# EAGLE design stm32f103c8_jlinkob_v2 (EAGLE 7.6.0)
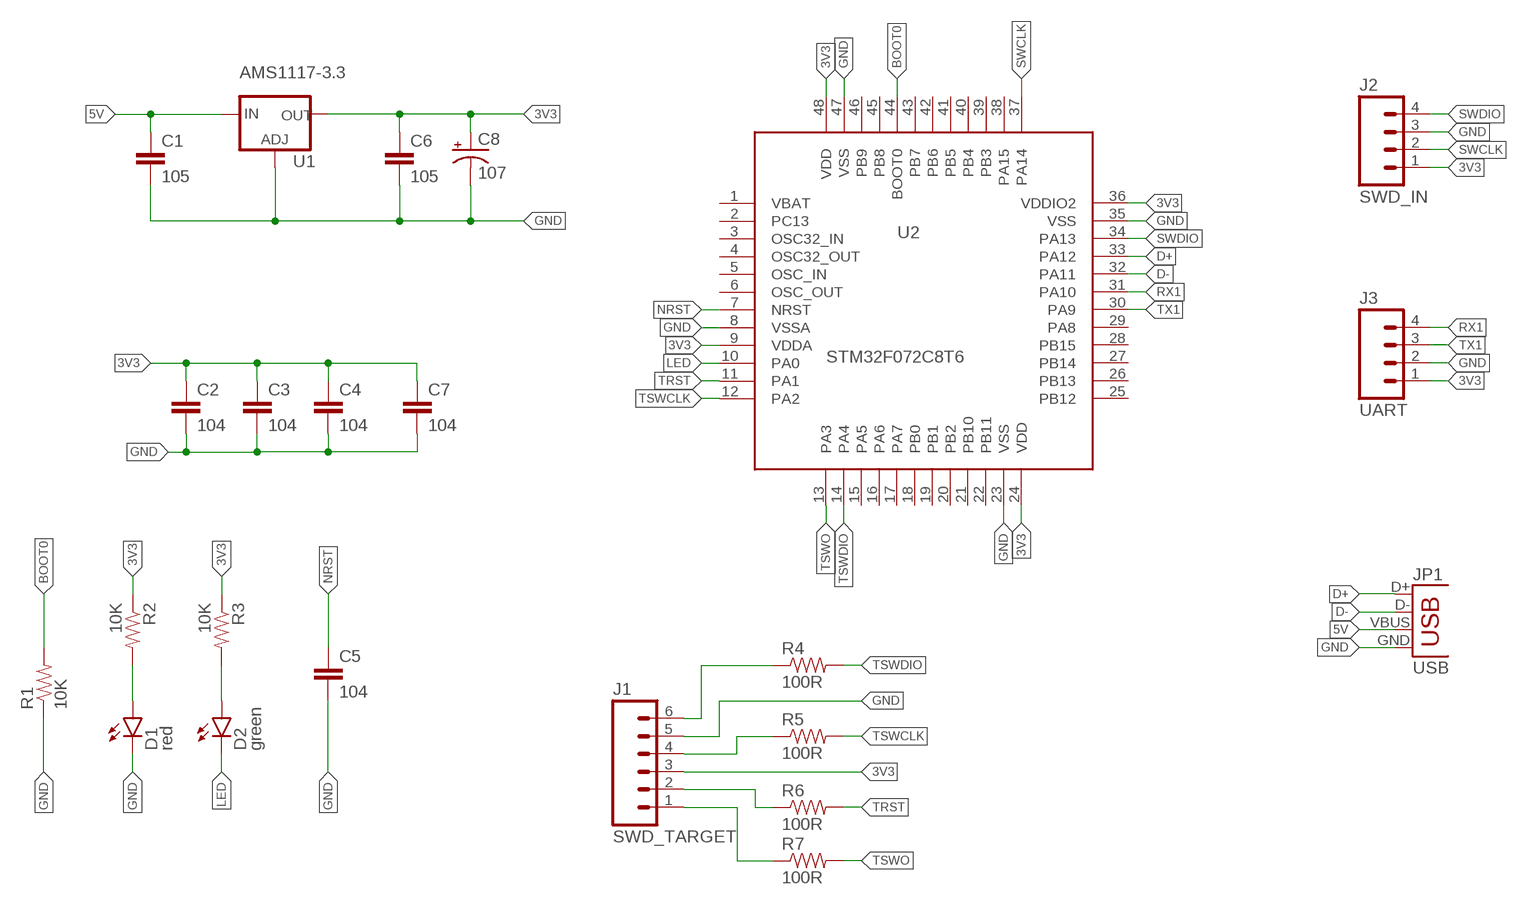
[diagram p0: schematic, sheet 1]

## Parts
C1  105  CAP0603-CAP  [0603-CAP]
C2  104  CAP0603-CAP  [0603-CAP]
C3  104  CAP0603-CAP  [0603-CAP]
C4  104  CAP0603-CAP  [0603-CAP]
C5  104  CAP0603-CAP  [0603-CAP]
C6  105  CAP0603-CAP  [0603-CAP]
C7  104  CAP0603-CAP  [0603-CAP]
C8  107  CAP_POL3528  [EIA3528]
D1  red  LED-SEEED-0603  [LED-0603-SEEED]
D2  green  LED-SEEED-0603  [LED-0603-SEEED]
J1  SWD_TARGET  M06NO_SILK_FEMALE_PTH  [1X06_NO_SILK]
J2  SWD_IN  M041X04_NO_SILK  [1X04_NO_SILK]
J3  UART  M041X04_NO_SILK  [1X04_NO_SILK]
JP1  USB  [MICROUSB-U-F-M5DD-Y-1]
R1  10K  RESISTOR0603  [0603-RES]
R2  10K  RESISTOR0603  [0603-RES]
R3  10K  RESISTOR0603  [0603-RES]
R4  100R  RESISTOR0603  [0603-RES]
R5  100R  RESISTOR0603  [0603-RES]
R6  100R  RESISTOR0603  [0603-RES]
R7  100R  RESISTOR0603  [0603-RES]
U1  AMS1117-3.3  AMS1117SOT223  [SOT223]
U2  STM32F072C8T6  [LQFP-48]

## Nets
3V3: C2.1 C3.1 C4.1 C6.1 C7.1 C8.A(+) J1.3 J2.1 J3.1 R2.1 R3.1 U1.2(OUT) U1.4(OUT) U2.9(VDDA) U2.24(VDD) U2.36(VDDIO2) U2.48(VDD)
5V: C1.1 JP1.VBUS U1.3(IN)
BOOT0: R1.2 U2.44(BOOT0)
D+: JP1.D+ U2.33(PA12)
D-: JP1.D- U2.32(PA11)
GND: C1.2 C2.2 C3.2 C4.2 C5.2 C6.2 C7.2 C8.C(-) D1.-(C) J1.5 J2.3 J3.2 JP1.GND R1.1 U1.1(ADJ) U2.8(VSSA) U2.23(VSS) U2.35(VSS) U2.47(VSS)
LED: D2.-(C) U2.10(PA0)
N$1: D2.+(A) R3.2
N$2: J1.6 R4.1
N$4: J1.4 R5.1
N$5: D1.+(A) R2.2
N$7: J1.2 R6.1
N$8: J1.1 R7.1
NRST: C5.1 U2.7(NRST)
RX1: J3.4 U2.31(PA10)
SWCLK: J2.2 U2.37(PA14)
SWDIO: J2.4 U2.34(PA13)
TRST: R6.2 U2.11(PA1)
TSWCLK: R5.2 U2.12(PA2)
TSWDIO: R4.2 U2.14(PA4)
TSWO: R7.2 U2.13(PA3)
TX1: J3.3 U2.30(PA9)
Unconnected: U2.1(VBAT) U2.2(PC13) U2.3(OSC32_IN) U2.4(OSC32_OUT) U2.5(OSC_IN) U2.6(OSC_OUT) U2.15(PA5) U2.16(PA6) U2.17(PA7) U2.18(PB0) U2.19(PB1) U2.20(PB2) U2.21(PB10) U2.22(PB11) U2.25(PB12) U2.26(PB13) U2.27(PB14) U2.28(PB15) U2.29(PA8) U2.38(PA15) U2.39(PB3) U2.40(PB4) U2.41(PB5) U2.42(PB6) U2.43(PB7) U2.45(PB8) U2.46(PB9)

## Library data of the parts
C1-C7 = z_jlc_smt:CAP: Capacitor Standard 0603 ceramic capacitor, and 0.1" leaded capacitor.
C8 = z_jlc_smt:CAP_POL: Capacitor Polarized These are standard SMD and PTH capacitors. Normally 10uF, 47uF, and 100uF in electrolytic and tantalum varieties. Always verify the external diameter of the through hole cap, it varies with capacity, voltage, and manufacturer. The EIA devices should be standard.
D1 D2 = z_jlc_smt:LED: LEDs Standard schematic elements and footprints for 5mm, 3mm, 1206, and 0603 sized LEDs. 5mm - Spark Fun Electronics SKU : COM-00529 (and others)
J1 = SparkFun-Connectors:M06: Header 6 Standard 6-pin 0.1" header. Use with straight break away headers (SKU : PRT-00116), right angle break away headers (PRT-00553), swiss pins (PRT-00743), machine pins (PRT-00117), and female headers (PRT-00115). Molex polarized connector foot print use with SKU : PRT-08094 with associated crimp pins and housings. NOTES ON THE VARIANTS LOCK and LOCK_LONGPADS... This footprint was designed to help hold the alignment of a through-hole component (i.e. 6-pin header) while soldering it into place. You may notice that each hole has been shifted either up or down by 0.005 of an inch from it's more standard position (which is a perfectly straight line). This slight alteration caused the pins (the squares in the middle) to touch the edges of the holes. Because they are alternating, it causes a "brace" to hold the component in place. 0.005 has proven to be the perfect amount of "off-center" position when using our standard breakaway headers. Although looks a little odd when you look at the bare footprint, once you have a header in there, the alteration is very hard to notice. Also,if you push a header all the way into place, it is covered up entirely on the bottom side. This idea of altering the position of holes to aid alignment will be further integrated into the Sparkfun Library for other footprints. It can help hold any component with 3 or more connection pins.; PROD_ID: CONN-08437
J2 J3 = SparkFun-Connectors:M04: Header 4 Standard 4-pin 0.1" header. Use with straight break away headers (SKU : PRT-00116), right angle break away headers (PRT-00553), swiss pins (PRT-00743), machine pins (PRT-00117), and female headers (PRT-00115). Molex polarized connector foot print use with SKU : PRT-08231 with associated crimp pins and housings. 1MM SMD Version SKU: PRT-10208; PROD_ID: CONN-09696
JP1 = xmgu2008:USB: USB Connectors USB-B-PTH is fully proven SKU : PRT-00139/CONN-08278 USB-miniB is fully proven SKU : PRT-00587 USB-A-PCB is untested. USB-A-H is throughly reviewed, but untested. Spark Fun Electronics SKU : PRT-00437 USB-B-SMT is throughly reviewed, but untested. Needs silkscreen touching up. USB-A-S has not been used/tested USB-MB-H has not been used/tested USB-MICROB has been used. CONN-09505
R1-R7 = z_jlc_smt:RESISTOR: Resistor Basic schematic elements and footprints for 0603, 1206, and PTH resistors.
U1 = z_jlc_smt:AMS1117: Voltage Regulator AMS1117; PROD_ID: VREG-08170
U2 = z_jlc_smt:STM32F072C8T6

## Board
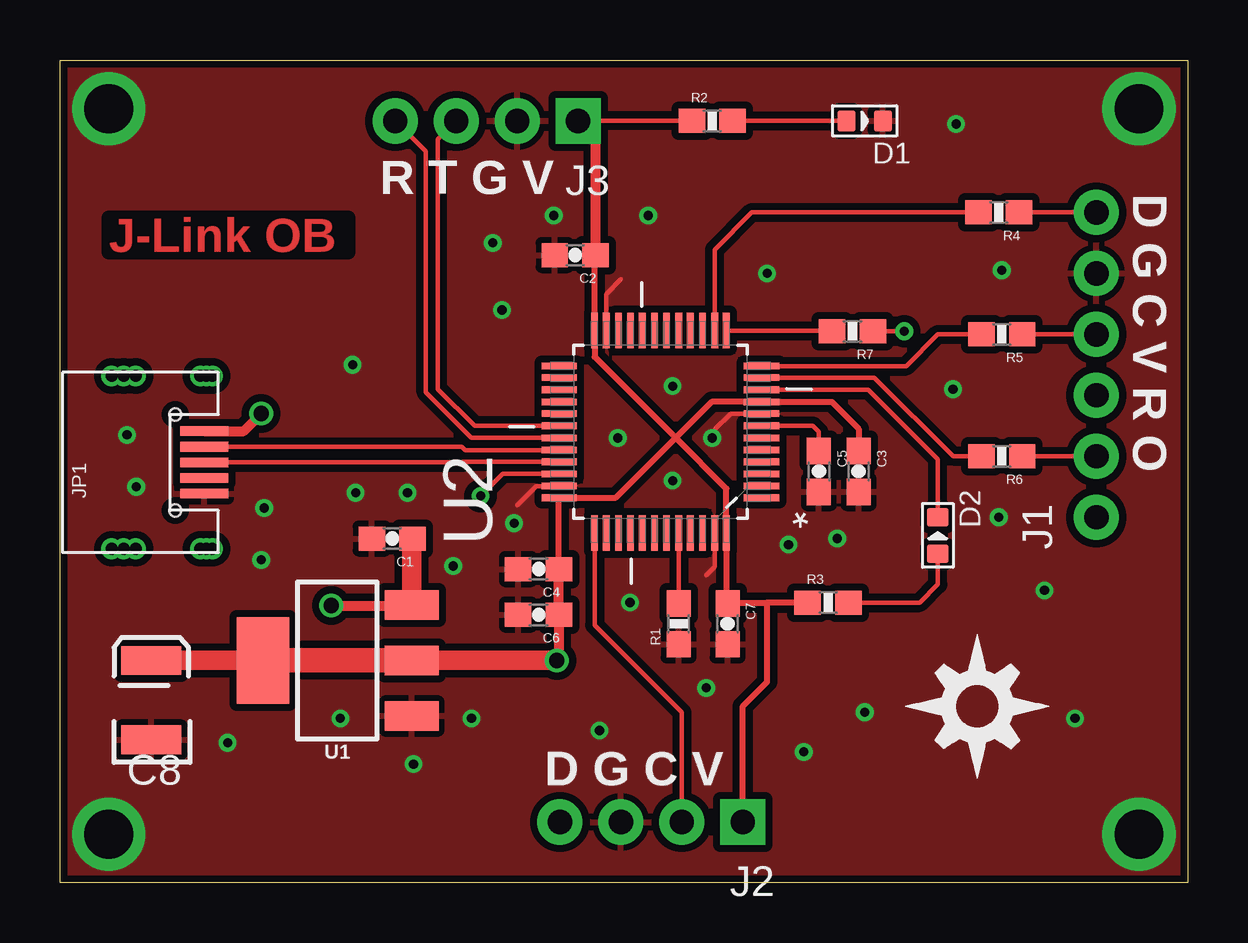
[diagram p1: board, top side]
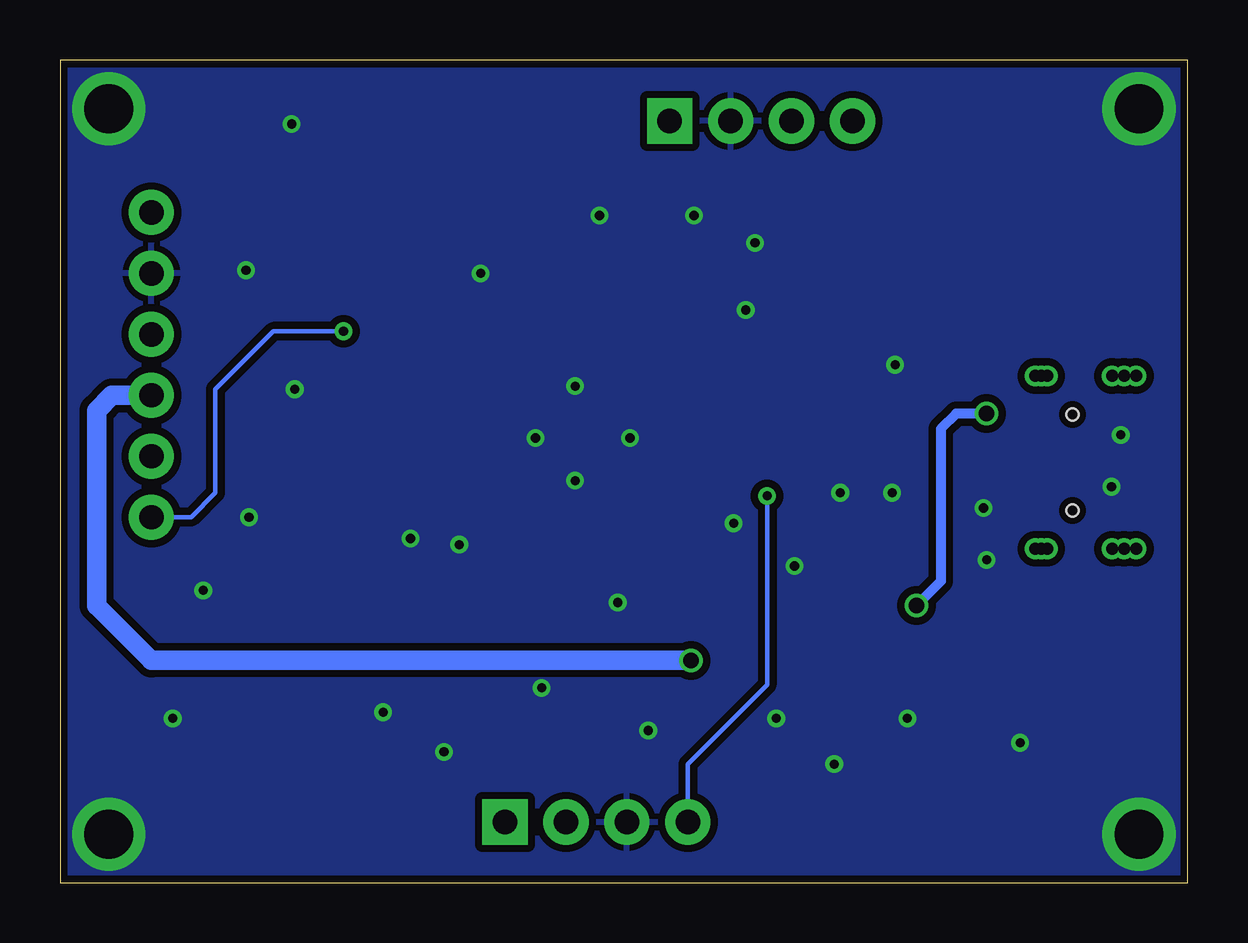
[diagram p2: board, bottom side, seen from below]

Size 46.99 x 34.29 mm. Coordinates in mm from the lower left corner, seen from the top.
Outline: 0,0 0,34.29 46.99,34.29 46.99,0 0,0
Copper layers (1*16): Top 0.035mm / dielectric 1.5mm / Bottom 0.035mm
Design rules "SparkFun-2-layer-TIGHT": minimum track width 7mil, minimum drill 15mil, track to track 7mil, track to pad 7mil, pad to pad 7mil, via to via 7mil, smd to smd 7mil, copper to edge 7mil, drill to drill 7mil, minimum pad ring 7mil, minimum via ring 7mil, stop-mask expansion 4mil, vias tented up to drill 20mil, thermal gap 10mil

### Footprints (pad centres in the part's own frame; a part is rotated, then mirrored left to right if it is on the bottom)
0603-CAP = smd 1.1 x 1: 1 -0.85,0; 2 0.85,0
EIA3528 = smd 1.2 x 2.5: A 1.65,0; C -1.65,0
LED-0603-SEEED = smd 0.762 x 0.889: + 0.762,0; - -0.762,0
1X06_NO_SILK = drill 1.016 pad 1.88: 1 0,0; 2 2.54,0; 3 5.08,0; 4 7.62,0; 5 10.16,0; 6 12.7,0
1X04_NO_SILK = drill 1.016 pad 1.88 square: 1 0,0 | drill 1.016 pad 1.88: 2 2.54,0; 3 5.08,0; 4 7.62,0
MICROUSB-U-F-M5DD-Y-1 = drill 0.5: 6_1 3.6,0.25; 6_2 3.6,0.5; 6_3 3.6,0.75; 7_1 3.6,3.45; 7_2 3.6,3.95; 7_3 3.6,4.45; 8_1 -3.6,4.45; 8_2 -3.6,3.95; 8_3 -3.6,3.45; 9_1 -3.6,0.75; 9_2 -3.6,0.5; 9_3 -3.6,0.25 | smd 0.4 x 2: D+ 0,0.6; D- 0.65,0.6; GND -1.3,0.6; ID -0.65,0.6; VBUS 1.3,0.6 | hole 0.5: -2,1.8; 2,1.8
0603-RES = smd 1.1 x 1: 1 -0.85,0; 2 0.85,0
SOT223 = smd 2.235 x 1.219: 1 3.099,-2.311; 2 3.099,0; 3 3.099,2.311 | smd 2.2 x 3.6: 4 -3.099,0
LQFP-48 = smd 0.279 x 1.473: 1 -2.743,-4.216; 2 -2.261,-4.216; 3 -1.753,-4.216; 4 -1.245,-4.216; 5 -0.762,-4.216; 6 -0.254,-4.216; 7 0.254,-4.216; 8 0.762,-4.216; 9 1.245,-4.216; 10 1.753,-4.216; 11 2.261,-4.216; 12 2.743,-4.216; 25 2.743,4.216; 26 2.261,4.216; 27 1.753,4.216; 28 1.245,4.216; 29 0.762,4.216; 30 0.254,4.216; 31 -0.254,4.216; 32 -0.762,4.216; 33 -1.245,4.216; 34 -1.753,4.216; 35 -2.261,4.216; 36 -2.743,4.216 | smd 1.473 x 0.279: 13 4.216,-2.743; 14 4.216,-2.261; 15 4.216,-1.753; 16 4.216,-1.245; 17 4.216,-0.762; 18 4.216,-0.254; 19 4.216,0.254; 20 4.216,0.762; 21 4.216,1.245; 22 4.216,1.753; 23 4.216,2.261; 24 4.216,2.743; 37 -4.216,2.743; 38 -4.216,2.261; 39 -4.216,1.753; 40 -4.216,1.245; 41 -4.216,0.762; 42 -4.216,0.254; 43 -4.216,-0.254; 44 -4.216,-0.762; 45 -4.216,-1.245; 46 -4.216,-1.753; 47 -4.216,-2.261; 48 -4.216,-2.743

### Placement (x,y rotation side)
C1  13.84,14.35 180 top
C2  21.46,26.16 180 top
C3  33.27,17.14 270 top
C4  19.94,13.08 180 top
C5  31.62,17.14 270 top
C6  19.94,11.18 180 top
C7  27.81,10.79 270 top
C8  3.81,7.62 90 top
D1  33.53,31.75 180 top
D2  36.58,14.48 270 top
J1  43.18,15.24 90 top
J2  28.45,2.54 180 top
J3  21.59,31.75 180 top
JP1  6.6,17.53 90 top
R1  25.78,10.79 90 top
R2  27.18,31.75 0 top
R3  32,11.68 0 top
R4  39.12,27.94 180 top
R5  39.24,22.86 180 top
R6  39.24,17.78 180 top
R7  33.02,22.99 180 top
U1  11.56,9.27 0 top
U2  25.02,18.8 90 top
U$1  [DIYNOVA_LOGO]  35.18,4.32 0 top

### Tracks (layer width: path | path; a pad name or v marks a point on that pad's centre or on a via)
3V3  (via drill 0.64)
  Top 0.178: 27.85,11.68 C7.1 | R2.1 J3.1
  Top 0.254: C2.1 22.28,26.12 U2.24 22.28,21.92 25.65,18.54 | 25.65,18.54 23.16,16.05 U2.36 C4.1 | 25.65,18.54 27.15,20.04 U2.9 32.16,20.04 33.27,18.92 C3.1 | 25.65,18.54 27.76,16.43 U2.48 27.76,11.7 C7.1 | J2.1 28.45,7.37 29.46,8.38 29.46,11.68 | 27.85,11.68 29.46,11.68 | R3.1 29.46,11.68
  Top 0.406: C2.1 22.31,31.03 J3.1 | C4.1 C6.1 20.79,9.36 v20.7,9.27
  Top 0.813: C8.A U1.4 | U1.2 v20.7,9.27
  Top 1.016: U1.2 U1.4
  Bottom 0.813: v20.7,9.27 43.18,9.27 45.47,11.56 45.47,19.68 44.83,20.32 J1.3
5V  (via drill 0.64)
  Top 0.406: JP1.VBUS 7.65,18.83 v8.38,19.56 | v11.3,11.56 14.63,11.56 U1.3
  Top 0.813: U1.3 14.66,14.31 C1.1
  Bottom 0.406: v8.38,19.56 9.65,19.56 10.29,18.92 10.29,12.57 v11.3,11.56
BOOT0
  Top 0.178: U2.44 R1.2
D+
  Top 0.178: JP1.D+ 16.76,17.53 16.79,17.55 U2.33
D-
  Top 0.178: JP1.D- 16.75,18.18 16.89,18.03 U2.32
GND  (via drill 0.38, 2.03)
  Top 0.178: U2.23 22.76,24.54 23.37,25.15 | U2.47 27.28,13.18 26.92,12.83 | U2.35 19.84,16.54 19.05,15.75 | U2.8 27.94,19.56 27.3,18.92
  other vias: 32.38,14.35 37.21,20.57 29.46,25.4 24.51,27.81 23.24,18.54 25.53,20.7 25.53,16.76 27.18,18.54 18.92,14.99 18.41,23.88 12.19,21.59 23.75,11.68 20.57,27.81 17.14,6.86 14.73,4.95 22.48,6.35 26.92,8.13 2.03,32.26 2.03,2.03 44.96,32.26 44.96,2.03 8.51,15.62 3.17,16.51 30.35,14.1 39.12,15.24 41.02,12.19 42.29,6.86 33.53,7.11 30.99,5.46 11.68,6.86 6.99,5.84 8.38,13.46 18.03,26.67 37.34,31.62 39.24,25.53 2.79,18.67 12.32,16.26 14.48,16.26 16.38,13.21
  pour Top (isolate 0.305): 0,0 0,34.29 46.99,34.29 46.99,0
  pour Bottom (isolate 0.305): 0,0 0,34.29 46.99,34.29 46.99,0
LED
  Top 0.178: U2.10 33.68,20.55 36.58,17.65 D2.-
N$1
  Top 0.178: R3.2 35.81,11.68 36.58,12.45 D2.+
N$2
  Top 0.178: R4.1 J1.6
N$4
  Top 0.178: R5.1 J1.4
N$5
  Top 0.178: R2.2 D1.+
N$7
  Top 0.178: R6.1 J1.2
N$8  (via drill 0.38)
  Top 0.178: R7.1 v35.18,22.99
  Bottom 0.178: v35.18,22.99 38.1,22.99 40.51,20.57 40.51,16.26 41.53,15.24 J1.1
NRST
  Top 0.178: U2.7 31.37,19.05 31.62,18.8 C5.1
RX1
  Top 0.178: U2.31 17.14,18.54 15.24,20.45 15.24,30.48 J3.4
SWCLK
  Top 0.178: U2.37 22.28,10.74 25.91,7.11 J2.2
SWDIO  (via drill 0.38)
  Top 0.178: U2.34 18.44,17.04 v17.53,16.13
  Bottom 0.178: v17.53,16.13 17.53,8.26 20.83,4.95 J2.4
TRST
  Top 0.178: U2.11 33.93,21.06 37.21,17.78 R6.2
TSWCLK
  Top 0.178: U2.12 35.26,21.54 36.58,22.86 R5.2
TSWDIO
  Top 0.178: U2.14 27.28,26.39 28.83,27.94 R4.2
TSWO
  Top 0.178: U2.13 32.15,23.01 R7.2
TX1
  Top 0.178: U2.30 17.27,19.05 15.75,20.57 15.75,30.99 J3.3

### Text on the board
Top: J-Link OB
tPlace: R T G V | D G C V R O | D G C V